# Altium schematic sheet 最小系统.SchDoc
size D; SheetNumber: 1; SheetTotal: 1
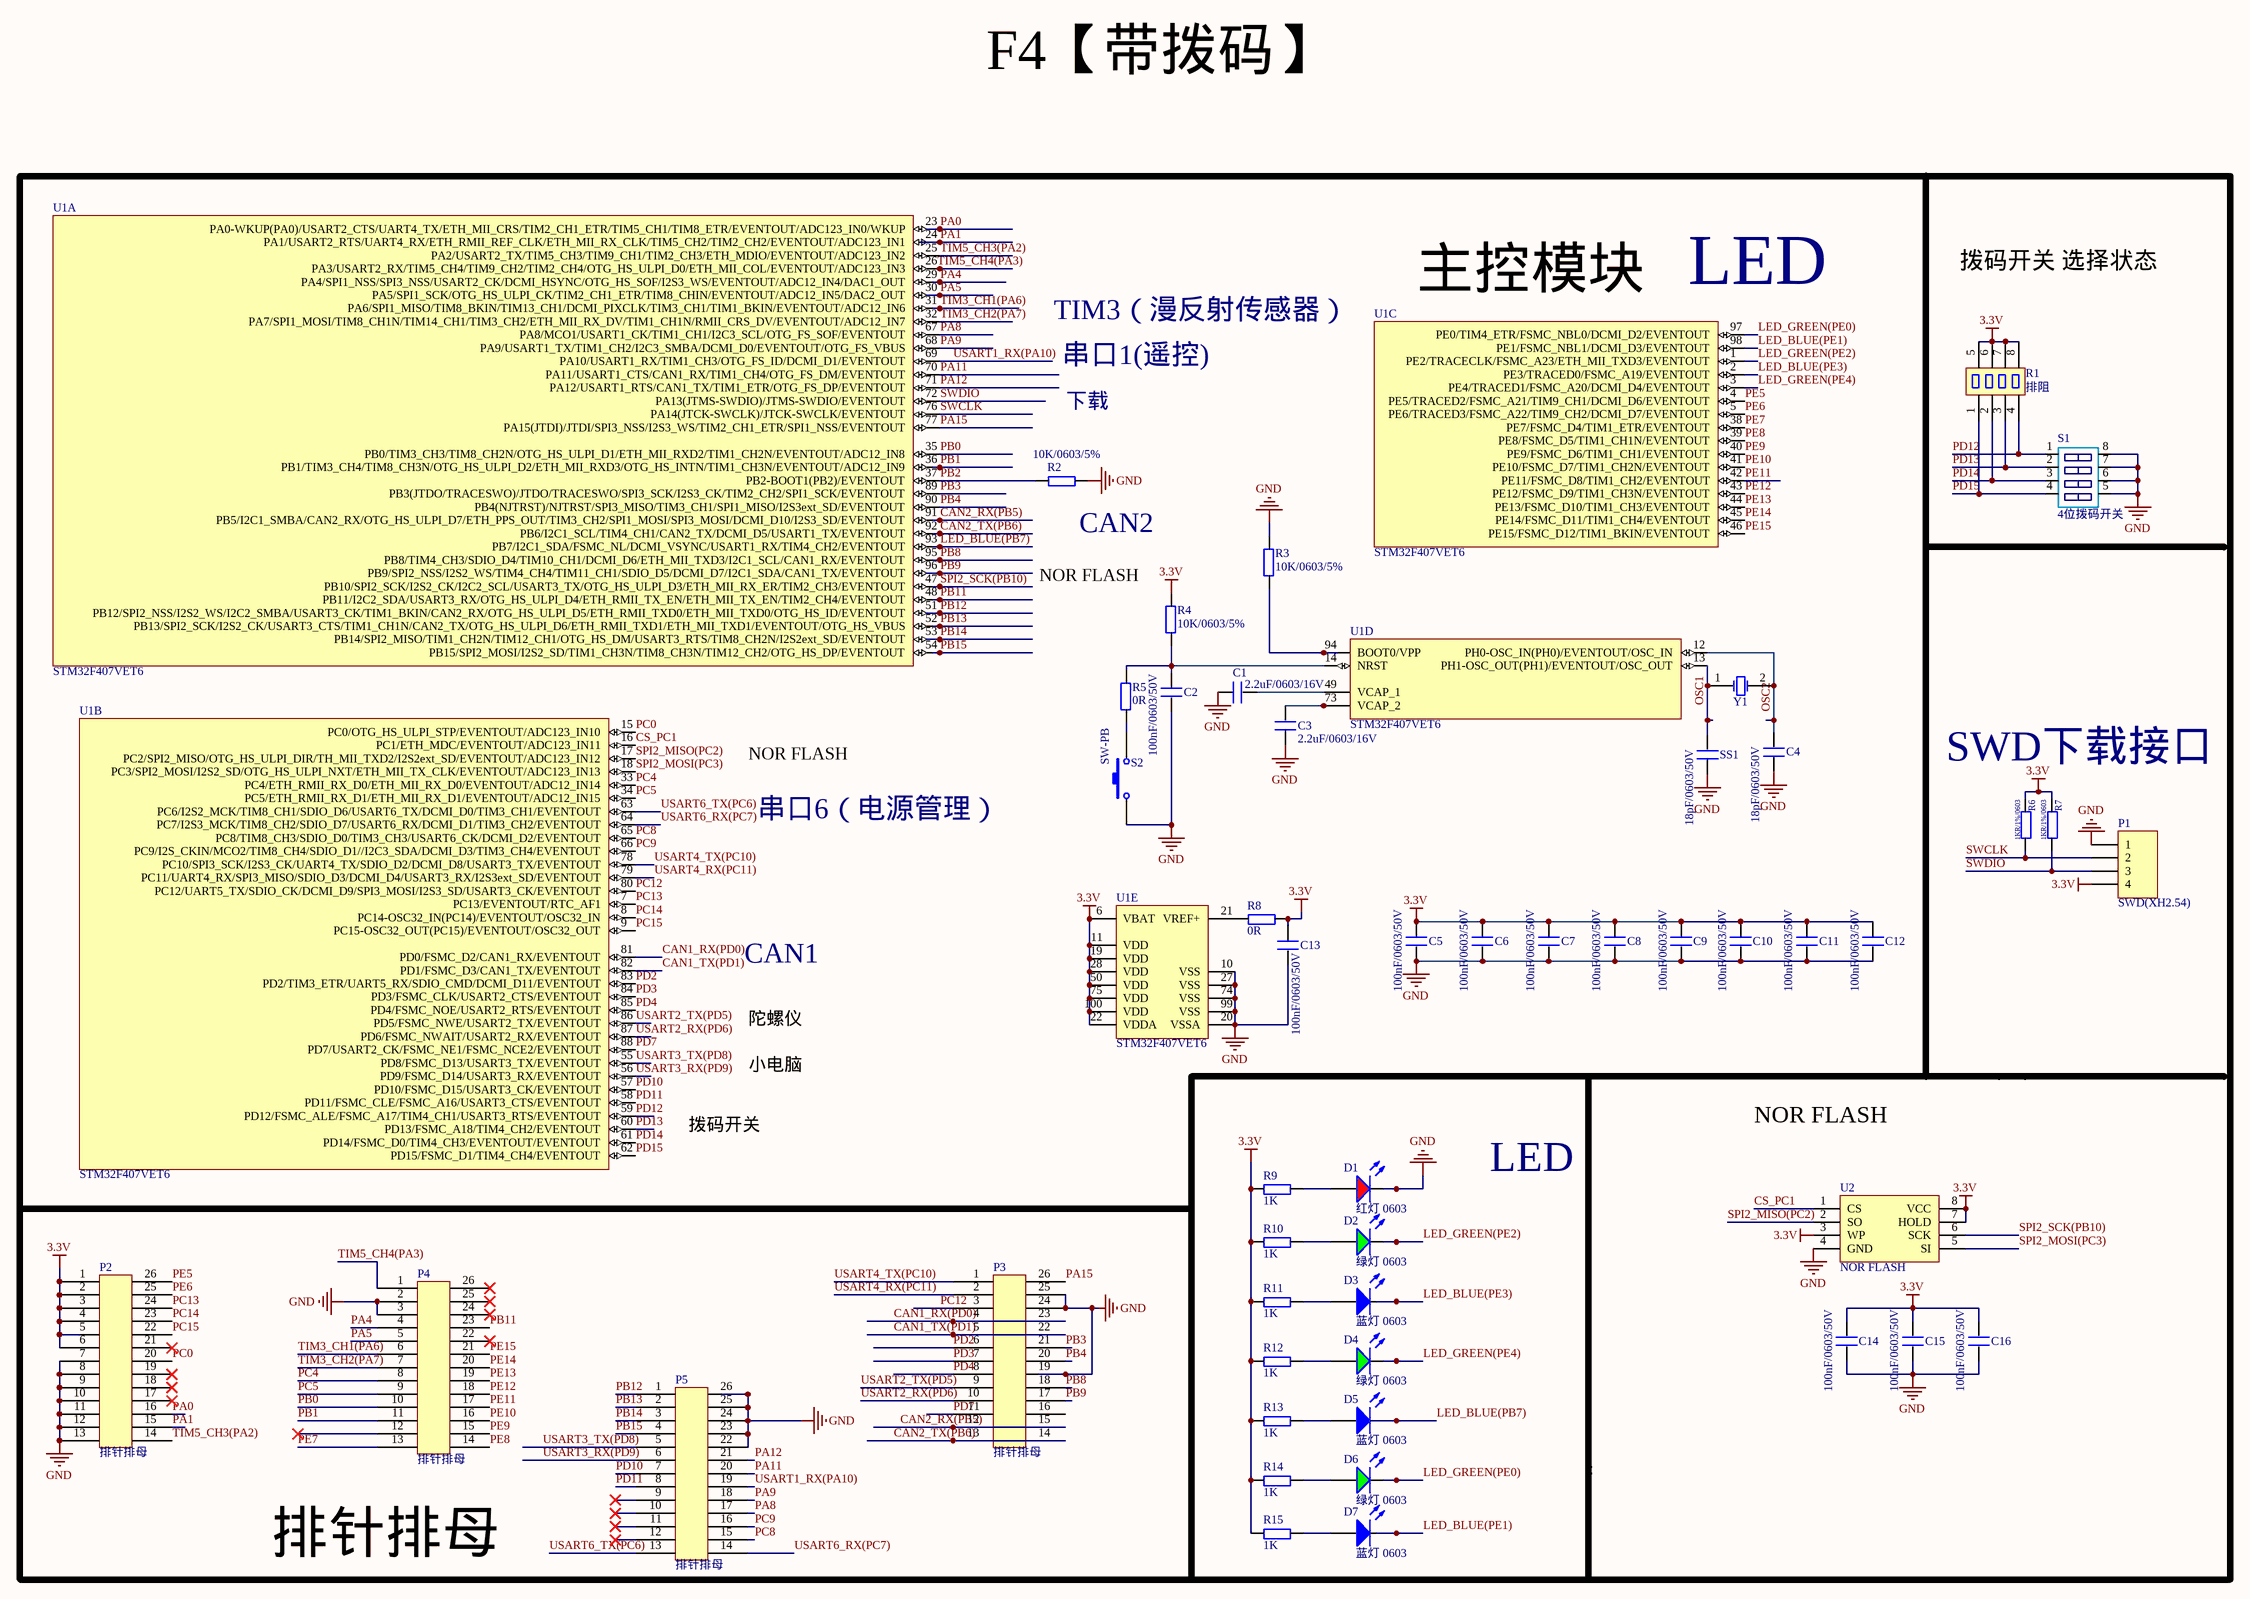
[diagram p0: 最小系统.SchDoc]

## Parts
C1  2.2uF/0603/16V  [0603C  1   2]
C2  100nF/0603/50V  [0603C  1   2]
C3  2.2uF/0603/16V  [0603C  1   2]
C4  18pF/0603/50V  [0603C  1   2]
C5  100nF/0603/50V  [0603C  1   2]
C6  100nF/0603/50V  [0603C  1   2]
C7  100nF/0603/50V  [0603C  1   2]
C8  100nF/0603/50V  [0603C  1   2]
C9  100nF/0603/50V  [0603C  1   2]
C10  100nF/0603/50V  [0603C  1   2]
C11  100nF/0603/50V  [0603C  1   2]
C12  100nF/0603/50V  [0603C  1   2]
C13  100nF/0603/50V  [0603C  1   2]
C14  100nF/0603/50V  [0603C  1   2]
C15  100nF/0603/50V  [0603C  1   2]
C16  100nF/0603/50V  [0603C  1   2]
D1  红灯 0603  [0603_LED_S1]
D2  绿灯 0603  [0603_LED_S1]
D3  蓝灯 0603  [0603_LED_S1]
D4  绿灯 0603  [0603_LED_S1]
D5  蓝灯 0603  [0603_LED_S1]
D6  绿灯 0603  [0603_LED_S1]
D7  蓝灯 0603  [0603_LED_S1]
P1  SWD(XH2.54)  [XH2.54 4P -]
P2  排针排母  [排针 13*2 2mm]
P3  排针排母  [排针 13*2 2mm-4]
P4  排针排母  [排针 13*2 2mm-2 - duplicate]
P5  排针排母  [排针 13*2 2mm-3 - duplicate]
R1  排阻  [排阻_1206]
R2  10K/0603/5%  [0603(偏大)]
R3  10K/0603/5%  [0603R  1   2]
R4  10K/0603/5%  [0603(偏大)]
R5  0R  [0603(偏大)]
R6  1KR/1%/0603  [0603(偏大)]
R7  1KR/1%/0603  [0603(偏大)]
R8  0R  [0603(偏大)]
R9  1K  [0603(偏大)]
R10  1K  [0603(偏大)]
R11  1K  [0603(偏大)]
R12  1K  [0603(偏大)]
R13  1K  [0603(偏大)]
R14  1K  [0603(偏大)]
R15  1K  [0603(偏大)]
S1  4位拨码开关  [4位拨码开关]
S2  SW-PB  [轻触开关]
SS1  18pF/0603/50V  [0603C  1   2]
U1  STM32F407VET6  [STM32F407VET6]  (parts A,B,C,D,E of 5)
U2  NOR FLASH  [SOIC_8_280mil]
Y1  12MHz  [25MHZ 2P 20PF]  (value not drawn)

## Nets
3.3V: C5.2 C6.2 C7.2 C8.2 C9.2 C10.2 C11.2 C12.2 C13.1 C14.2 C15.2 C16.2 P1.4 P2.1 P2.2 P2.3 P2.4 P2.5 P2.6 R1.5 R1.6 R1.7 R1.8 R4.1 R6.2 R7.2 R8.2 R9.1 R10.1 R11.1 R12.1 R13.1 R14.1 R15.1 U1.6(VBAT) U1.11(VDD) U1.19(VDD) U1.22(VDDA) U1.28(VDD) U1.50(VDD) U1.75(VDD) U1.100(VDD) U2.3(WP) U2.7(HOLD) U2.8(VCC)
GND: C1.1 C2.2 C3.1 C4.1 C5.1 C6.1 C7.1 C8.1 C9.1 C10.1 C11.1 C12.1 C13.2 C14.1 C15.1 C16.1 D1.K P1.1 P2.7 P2.8 P2.9 P2.10 P2.11 P2.12 P2.13 P3.19 P3.24 P3.25 P4.2 P4.3 P5.22 P5.23 P5.24 P5.25 P5.26 R2.2 R3.1 S1.5 S1.6 S1.7 S1.8 S2.1 SS1.1 U1.10(VSS) U1.20(VSSA) U1.27(VSS) U1.74(VSS) U1.99(VSS) U2.4(GND)
CAN1_RX(PD0): P3.4 P3.23 U1.81(PD0/FSMC_D2/CAN1_RX/EVENTOUT)
CAN1_TX(PD1): P3.5 P3.22 U1.82(PD1/FSMC_D3/CAN1_TX/EVENTOUT)
CAN2_RX(PB5): P3.12 P3.15 U1.91(PB5/I2C1_SMBA/CAN2_RX/OTG_HS_ULPI_D7/ETH_PPS_OUT/TIM3_CH2/SPI1_MOSI/SPI3_MOSI/DCMI_D10/I2S3_SD/EVENTOUT)
CAN2_TX(PB6): P3.13 P3.14 U1.92(PB6/I2C1_SCL/TIM4_CH1/CAN2_TX/DCMI_D5/USART1_TX/EVENTOUT)
CS_PC1: U1.16(PC1/ETH_MDC/EVENTOUT/ADC123_IN11) U2.1(CS)
LED_BLUE(PB7): D5.K U1.93(PB7/I2C1_SDA/FSMC_NL/DCMI_VSYNC/USART1_RX/TIM4_CH2/EVENTOUT)
LED_BLUE(PE1): D7.K U1.98(PE1/FSMC_NBL1/DCMI_D3/EVENTOUT)
LED_BLUE(PE3): D3.K U1.2(PE3/TRACED0/FSMC_A19/EVENTOUT)
LED_GREEN(PE0): D6.K U1.97(PE0/TIM4_ETR/FSMC_NBL0/DCMI_D2/EVENTOUT)
LED_GREEN(PE2): D2.K U1.1(PE2/TRACECLK/FSMC_A23/ETH_MII_TXD3/EVENTOUT)
LED_GREEN(PE4): D4.K U1.3(PE4/TRACED1/FSMC_A20/DCMI_D4/EVENTOUT)
OSC1: SS1.2 U1.13(PH1-OSC_OUT(PH1)/EVENTOUT/OSC_OUT) Y1.1(OSC1)
OSC2: C4.2 U1.12(PH0-OSC_IN(PH0)/EVENTOUT/OSC_IN) Y1.2(OSC2)
PA0: P2.16 U1.23(PA0-WKUP(PA0)/USART2_CTS/UART4_TX/ETH_MII_CRS/TIM2_CH1_ETR/TIM5_CH1/TIM8_ETR/EVENTOUT/ADC123_IN0/WKUP)
PA1: P2.15 U1.24(PA1/USART2_RTS/UART4_RX/ETH_RMII_REF_CLK/ETH_MII_RX_CLK/TIM5_CH2/TIM2_CH2/EVENTOUT/ADC123_IN1)
PA4: P4.4 U1.29(PA4/SPI1_NSS/SPI3_NSS/USART2_CK/DCMI_HSYNC/OTG_HS_SOF/I2S3_WS/EVENTOUT/ADC12_IN4/DAC1_OUT)
PA5: P4.5 U1.30(PA5/SPI1_SCK/OTG_HS_ULPI_CK/TIM2_CH1_ETR/TIM8_CHIN/EVENTOUT/ADC12_IN5/DAC2_OUT)
PA8: P5.17 U1.67(PA8/MCO1/USART1_CK/TIM1_CH1/I2C3_SCL/OTG_FS_SOF/EVENTOUT)
PA9: P5.18 U1.68(PA9/USART1_TX/TIM1_CH2/I2C3_SMBA/DCMI_D0/EVENTOUT/OTG_FS_VBUS)
PA11: P5.20 U1.70(PA11/USART1_CTS/CAN1_RX/TIM1_CH4/OTG_FS_DM/EVENTOUT)
PA12: P5.21 U1.71(PA12/USART1_RTS/CAN1_TX/TIM1_ETR/OTG_FS_DP/EVENTOUT)
PA15: P3.26 U1.77(PA15(JTDI)/JTDI/SPI3_NSS/I2S3_WS/TIM2_CH1_ETR/SPI1_NSS/EVENTOUT)
PB0: P4.10 U1.35(PB0/TIM3_CH3/TIM8_CH2N/OTG_HS_ULPI_D1/ETH_MII_RXD2/TIM1_CH2N/EVENTOUT/ADC12_IN8)
PB1: P4.11 U1.36(PB1/TIM3_CH4/TIM8_CH3N/OTG_HS_ULPI_D2/ETH_MII_RXD3/OTG_HS_INTN/TIM1_CH3N/EVENTOUT/ADC12_IN9)
PB2: R2.1 U1.37(PB2-BOOT1(PB2)/EVENTOUT)
PB3: P3.21 U1.89(PB3(JTDO/TRACESWO)/JTDO/TRACESWO/SPI3_SCK/I2S3_CK/TIM2_CH2/SPI1_SCK/EVENTOUT)
PB4: P3.20 U1.90(PB4(NJTRST)/NJTRST/SPI3_MISO/TIM3_CH1/SPI1_MISO/I2S3ext_SD/EVENTOUT)
PB8: P3.18 U1.95(PB8/TIM4_CH3/SDIO_D4/TIM10_CH1/DCMI_D6/ETH_MII_TXD3/I2C1_SCL/CAN1_RX/EVENTOUT)
PB9: P3.17 U1.96(PB9/SPI2_NSS/I2S2_WS/TIM4_CH4/TIM11_CH1/SDIO_D5/DCMI_D7/I2C1_SDA/CAN1_TX/EVENTOUT)
PB11: P4.23 U1.48(PB11/I2C2_SDA/USART3_RX/OTG_HS_ULPI_D4/ETH_RMII_TX_EN/ETH_MII_TX_EN/TIM2_CH4/EVENTOUT)
PB12: P5.1 U1.51(PB12/SPI2_NSS/I2S2_WS/I2C2_SMBA/USART3_CK/TIM1_BKIN/CAN2_RX/OTG_HS_ULPI_D5/ETH_RMII_TXD0/ETH_MII_TXD0/OTG_HS_ID/EVENTOUT)
PB13: P5.2 U1.52(PB13/SPI2_SCK/I2S2_CK/USART3_CTS/TIM1_CH1N/CAN2_TX/OTG_HS_ULPI_D6/ETH_RMII_TXD1/ETH_MII_TXD1/EVENTOUT/OTG_HS_VBUS)
PB14: P5.3 U1.53(PB14/SPI2_MISO/TIM1_CH2N/TIM12_CH1/OTG_HS_DM/USART3_RTS/TIM8_CH2N/I2S2ext_SD/EVENTOUT)
PB15: P5.4 U1.54(PB15/SPI2_MOSI/I2S2_SD/TIM1_CH3N/TIM8_CH3N/TIM12_CH2/OTG_HS_DP/EVENTOUT)
PC0: P2.20 U1.15(PC0/OTG_HS_ULPI_STP/EVENTOUT/ADC123_IN10)
PC4: P4.8 U1.33(PC4/ETH_RMII_RX_D0/ETH_MII_RX_D0/EVENTOUT/ADC12_IN14)
PC5: P4.9 U1.34(PC5/ETH_RMII_RX_D1/ETH_MII_RX_D1/EVENTOUT/ADC12_IN15)
PC8: P5.15 U1.65(PC8/TIM8_CH3/SDIO_D0/TIM3_CH3/USART6_CK/DCMI_D2/EVENTOUT)
PC9: P5.16 U1.66(PC9/I2S_CKIN/MCO2/TIM8_CH4/SDIO_D1//I2C3_SDA/DCMI_D3/TIM3_CH4/EVENTOUT)
PC12: P3.3 U1.80(PC12/UART5_TX/SDIO_CK/DCMI_D9/SPI3_MOSI/I2S3_SD/USART3_CK/EVENTOUT)
PC13: P2.24 U1.7(PC13/EVENTOUT/RTC_AF1)
PC14: P2.23 U1.8(PC14-OSC32_IN(PC14)/EVENTOUT/OSC32_IN)
PC15: P2.22 U1.9(PC15-OSC32_OUT(PC15)/EVENTOUT/OSC32_OUT)
PD2: P3.6 U1.83(PD2/TIM3_ETR/UART5_RX/SDIO_CMD/DCMI_D11/EVENTOUT)
PD3: P3.7 U1.84(PD3/FSMC_CLK/USART2_CTS/EVENTOUT)
PD4: P3.8 U1.85(PD4/FSMC_NOE/USART2_RTS/EVENTOUT)
PD7: P3.11 U1.88(PD7/USART2_CK/FSMC_NE1/FSMC_NCE2/EVENTOUT)
PD10: P5.7 U1.57(PD10/FSMC_D15/USART3_CK/EVENTOUT)
PD11: P5.8 U1.58(PD11/FSMC_CLE/FSMC_A16/USART3_CTS/EVENTOUT)
PD12: R1.4 S1.1 U1.59(PD12/FSMC_ALE/FSMC_A17/TIM4_CH1/USART3_RTS/EVENTOUT)
PD13: R1.3 S1.2 U1.60(PD13/FSMC_A18/TIM4_CH2/EVENTOUT)
PD14: R1.2 S1.3 U1.61(PD14/FSMC_D0/TIM4_CH3/EVENTOUT/EVENTOUT)
PD15: R1.1 S1.4 U1.62(PD15/FSMC_D1/TIM4_CH4/EVENTOUT)
PE5: P2.26 U1.4(PE5/TRACED2/FSMC_A21/TIM9_CH1/DCMI_D6/EVENTOUT)
PE6: P2.25 U1.5(PE6/TRACED3/FSMC_A22/TIM9_CH2/DCMI_D7/EVENTOUT)
PE7: P4.13 U1.38(PE7/FSMC_D4/TIM1_ETR/EVENTOUT)
PE8: P4.14 U1.39(PE8/FSMC_D5/TIM1_CH1N/EVENTOUT)
PE9: P4.15 U1.40(PE9/FSMC_D6/TIM1_CH1/EVENTOUT)
PE10: P4.16 U1.41(PE10/FSMC_D7/TIM1_CH2N/EVENTOUT)
PE11: P4.17 U1.42(PE11/FSMC_D8/TIM1_CH2/EVENTOUT)
PE12: P4.18 U1.43(PE12/FSMC_D9/TIM1_CH3N/EVENTOUT)
PE13: P4.19 U1.44(PE13/FSMC_D10/TIM1_CH3/EVENTOUT)
PE14: P4.20 U1.45(PE14/FSMC_D11/TIM1_CH4/EVENTOUT)
PE15: P4.21 U1.46(PE15/FSMC_D12/TIM1_BKIN/EVENTOUT)
SPI2_MISO(PC2): U1.17(PC2/SPI2_MISO/OTG_HS_ULPI_DIR/TH_MII_TXD2/I2S2ext_SD/EVENTOUT/ADC123_IN12) U2.2(SO)
SPI2_MOSI(PC3): U1.18(PC3/SPI2_MOSI/I2S2_SD/OTG_HS_ULPI_NXT/ETH_MII_TX_CLK/EVENTOUT/ADC123_IN13) U2.5(SI)
SPI2_SCK(PB10): U1.47(PB10/SPI2_SCK/I2S2_CK/I2C2_SCL/USART3_TX/OTG_HS_ULPI_D3/ETH_MII_RX_ER/TIM2_CH3/EVENTOUT) U2.6(SCK)
SWCLK: P1.2 R6.1 U1.76(PA14(JTCK-SWCLK)/JTCK-SWCLK/EVENTOUT)
SWDIO: P1.3 R7.1 U1.72(PA13(JTMS-SWDIO)/JTMS-SWDIO/EVENTOUT)
TIM3_CH1(PA6): P4.6 U1.31(PA6/SPI1_MISO/TIM8_BKIN/TIM13_CH1/DCMI_PIXCLK/TIM3_CH1/TIM1_BKIN/EVENTOUT/ADC12_IN6)
TIM3_CH2(PA7): P4.7 U1.32(PA7/SPI1_MOSI/TIM8_CH1N/TIM14_CH1/TIM3_CH2/ETH_MII_RX_DV/TIM1_CH1N/RMII_CRS_DV/EVENTOUT/ADC12_IN7)
TIM5_CH3(PA2): P2.14 U1.25(PA2/USART2_TX/TIM5_CH3/TIM9_CH1/TIM2_CH3/ETH_MDIO/EVENTOUT/ADC123_IN2)
TIM5_CH4(PA3): P4.1 U1.26(PA3/USART2_RX/TIM5_CH4/TIM9_CH2/TIM2_CH4/OTG_HS_ULPI_D0/ETH_MII_COL/EVENTOUT/ADC123_IN3)
USART1_RX(PA10): P5.19 U1.69(PA10/USART1_RX/TIM1_CH3/OTG_FS_ID/DCMI_D1/EVENTOUT)
USART2_RX(PD6): P3.10 U1.87(PD6/FSMC_NWAIT/USART2_RX/EVENTOUT)
USART2_TX(PD5): P3.9 U1.86(PD5/FSMC_NWE/USART2_TX/EVENTOUT)
USART3_RX(PD9): P5.6 U1.56(PD9/FSMC_D14/USART3_RX/EVENTOUT)
USART3_TX(PD8): P5.5 U1.55(PD8/FSMC_D13/USART3_TX/EVENTOUT)
USART4_RX(PC11): P3.2 U1.79(PC11/UART4_RX/SPI3_MISO/SDIO_D3/DCMI_D4/USART3_RX/I2S3ext_SD/EVENTOUT)
USART4_TX(PC10): P3.1 U1.78(PC10/SPI3_SCK/I2S3_CK/UART4_TX/SDIO_D2/DCMI_D8/USART3_TX/EVENTOUT)
USART6_RX(PC7): P5.14 U1.64(PC7/I2S3_MCK/TIM8_CH2/SDIO_D7/USART6_RX/DCMI_D1/TIM3_CH2/EVENTOUT)
USART6_TX(PC6): P5.13 U1.63(PC6/I2S2_MCK/TIM8_CH1/SDIO_D6/USART6_TX/DCMI_D0/TIM3_CH1/EVENTOUT)
NetC1_2: C1.2 U1.49(VCAP_1)
NetC2_1: C2.1 R4.2 R5.1 U1.14(NRST)
NetC3_2: C3.2 U1.73(VCAP_2)
NetD1_A: D1.A R9.2
NetD2_A: D2.A R10.2
NetD3_A: D3.A R11.2
NetD4_A: D4.A R12.2
NetD5_A: D5.A R13.2
NetD6_A: D6.A R14.2
NetD7_A: D7.A R15.2
NetR3_2: R3.2 U1.94(BOOT0/VPP)
NetR5_2: R5.2 S2.2
NetR8_1: R8.1 U1.21(VREF+)

Not connected (* = marked no-connect by the designer): P2 17* 18* 19* 21*; P3 16; P4 12* 22* 24* 25* 26*; P5 9* 10* 11* 12*

## Notes on the sheet
- F4【带拨码】
- TIM3（漫反射传感器）
- 主控模块
- (near U1) LED
- 拨码开关 选择状态
- 串口1(遥控)
- 下载
- NOR FLASH
- (near R2) CAN2
- SWD下载接口
- 串口6（电源管理）
- CAN1
- 陀螺仪
- 拨码开关
- 小电脑
- LED
- 排针排母

## Library data of the parts
C1-C16 SS1 = C
D1 = 0603 红灯: 发光二极管; ComponentLink1Description: 供应商链接; ComponentLink1URL: http://www.szlcsc.com/product/details_2659.html; Package: 0603; Supplier: LC; SuppliersPartNumber: C2286
D2 D4 D6 = 0603 绿灯: 发光二极管; ComponentLink1Description: 供应商链接; ComponentLink1URL: http://www.szlcsc.com/product/details_73152.html; Package: 0603; Supplier: LC; SuppliersPartNumber: C72043
D3 D5 D7 = 0603 蓝灯: 发光二极管; ComponentLink1Description: 供应商链接; ComponentLink1URL: http://www.szlcsc.com/product/details_73150.html; Package: 0603; Supplier: LC; SuppliersPartNumber: C72041
P1 = Header 4: Header, 4-Pin; LatestRevisionDate: 17-Jul-2002; LatestRevisionNote: Re-released for DXP Platform.; Publisher: Altium Limited
P2-P5 = 13*2排针
R2-R15 = R
S2 = SW-PB: Switch; Published: 24-Mar-1999; LatestRevisionDate: 17-Jul-2002; LatestRevisionNote: Re-released for DXP Platform.; PackageReference: SPST-2; Publisher: Altium Limited; PackageDescription: Switch; 2 Leads
U1 = STM32F407VET6: ARM; ComponentLink1Description: 供应商链接; ComponentLink1URL: http://www.szlcsc.com/product/details_29482.html; Package: LQFP-100_14x14x05P; Supplier: LC; SuppliersPartNumber: C28730
Y1 = 晶振: Published: 8-Jun-2000; LatestRevisionDate: 17-Jul-2002; LatestRevisionNote: Re-released for DXP Platform.; PackageReference: R38; Publisher: Altium Limited; PackageDescription: Crystal, Thru-Hole; 2 Leads; Body 3.1 x 8.2 mm (Dia.xH)